# EAGLE design Procesor-MicroBit (EAGLE 9.4.0)
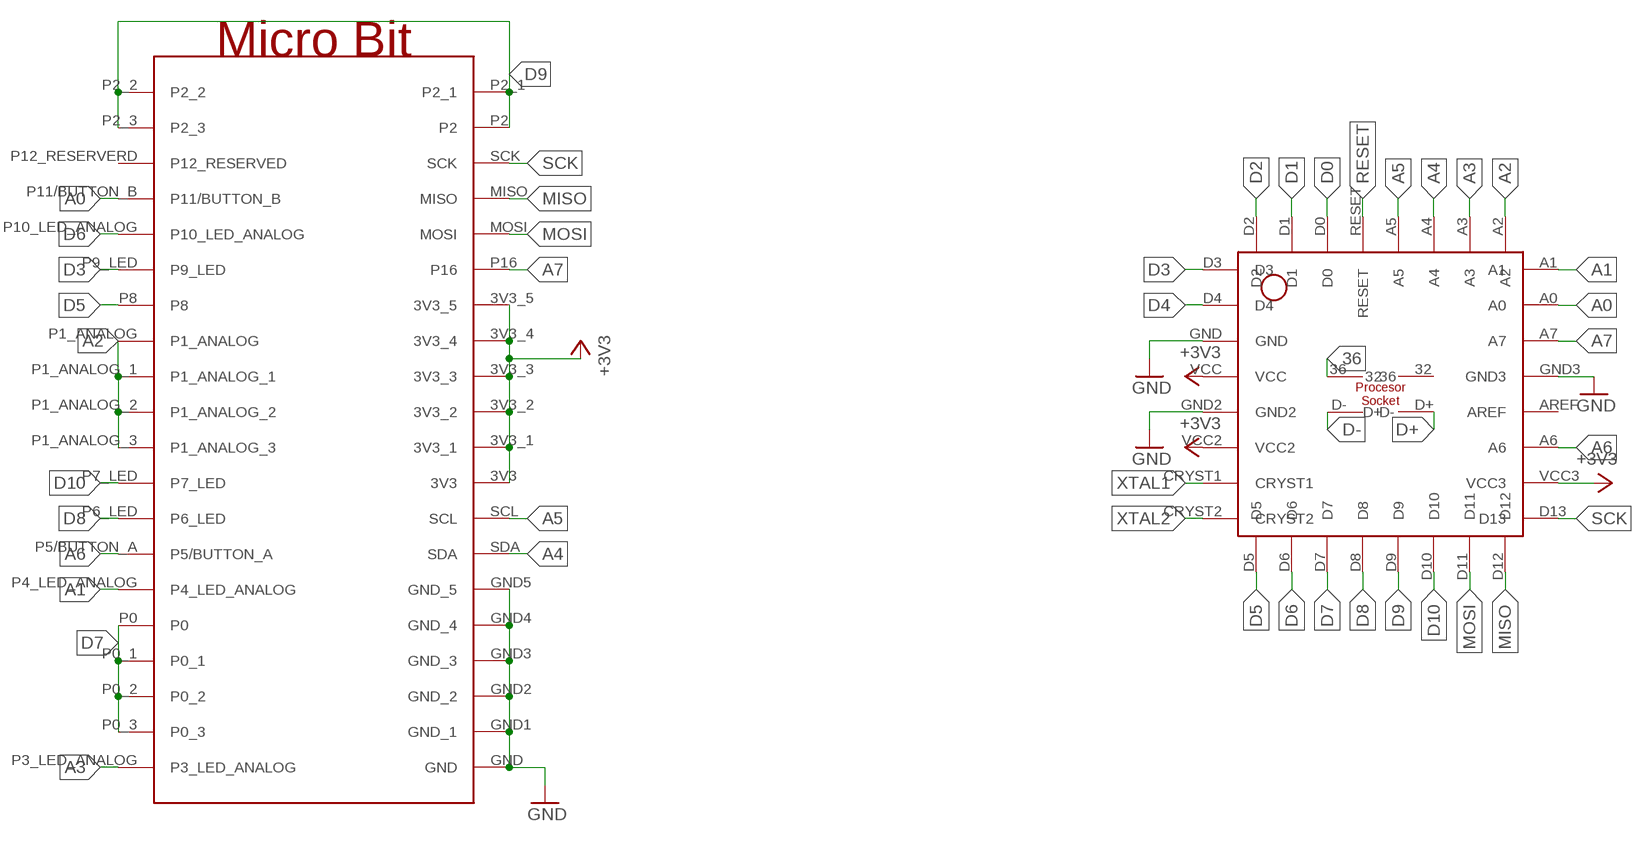
[diagram p0: schematic, sheet 1]

## Parts
U$1  MICRO_BIT  [MICRO_BIT]
U$2  PROCESSOR-SOCKET  [PROCESOR]

## Nets
36: U$2.36
+3V3: U$1.3V3 U$1.3V3_1 U$1.3V3_2 U$1.3V3_3 U$1.3V3_4 U$1.3V3_5 U$2.VCC U$2.VCC2 U$2.VCC3
A0: U$1.P11/BUTTON_B U$2.A0
A1: U$1.P4_LED_ANALOG U$2.A1
A2: U$1.P1_ANALOG U$1.P1_ANALOG_1 U$1.P1_ANALOG_2 U$1.P1_ANALOG_3 U$2.A2
A3: U$1.P3_LED_ANALOG U$2.A3
A4: U$1.SDA U$2.A4
A5: U$1.SCL U$2.A5
A6: U$1.P5/BUTTON_A U$2.A6
A7: U$1.P16 U$2.A7
D0: U$2.D0
D1: U$2.D1
D2: U$2.D2
D3: U$1.P9_LED U$2.D3
D4: U$2.D4
D5: U$1.P8 U$2.D5
D6: U$1.P10_LED_ANALOG U$2.D6
D7: U$1.P0 U$1.P0_1 U$1.P0_2 U$1.P0_3 U$2.D7
D8: U$1.P6_LED U$2.D8
D9: U$1.P2 U$1.P2_1 U$1.P2_2 U$1.P2_3 U$2.D9
D10: U$1.P7_LED U$2.D10
D+: U$2.D+
D-: U$2.D-
GND: U$1.GND U$1.GND1(GND_1) U$1.GND2(GND_2) U$1.GND3(GND_3) U$1.GND4(GND_4) U$1.GND5(GND_5) U$2.GND U$2.GND2 U$2.GND3
MISO: U$1.MISO U$2.D12
MOSI: U$1.MOSI U$2.D11
RESET: U$2.RESET
SCK: U$1.SCK U$2.D13
XTAL1: U$2.CRYST1
XTAL2: U$2.CRYST2
Unconnected: U$1.P12_RESERVERD(P12_RESERVED) U$2.32 U$2.AREF

## Library data of the parts
U$1 = Cing Library:MICRO_BIT
U$2 = Cing Library:PROCESSOR-SOCKET

## Board
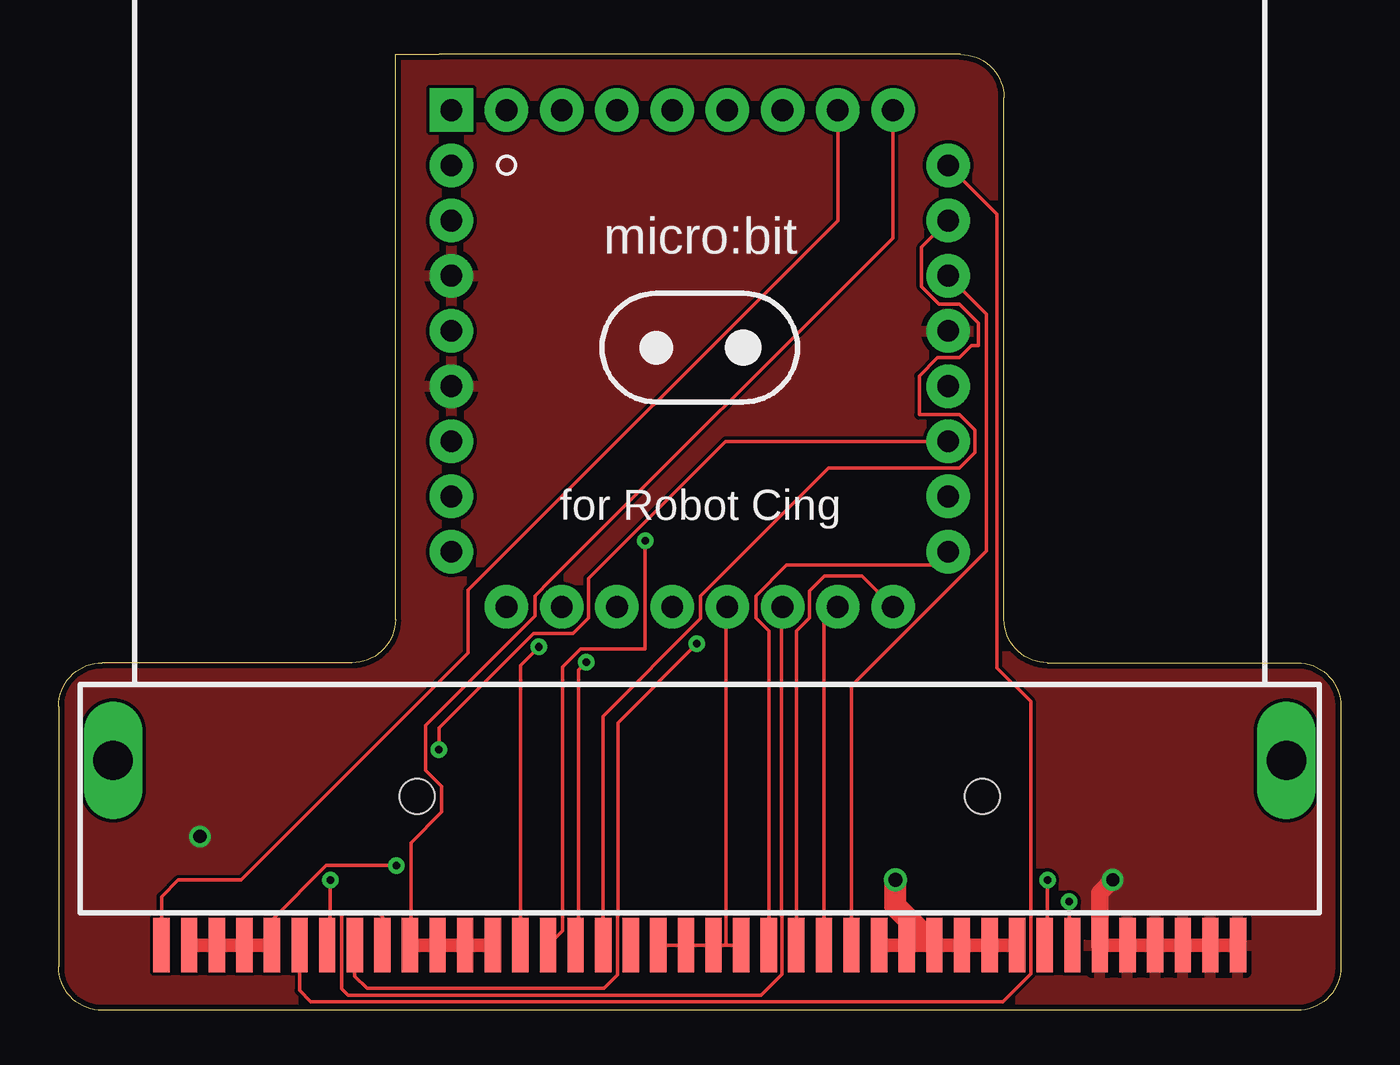
[diagram p1: board, top side]
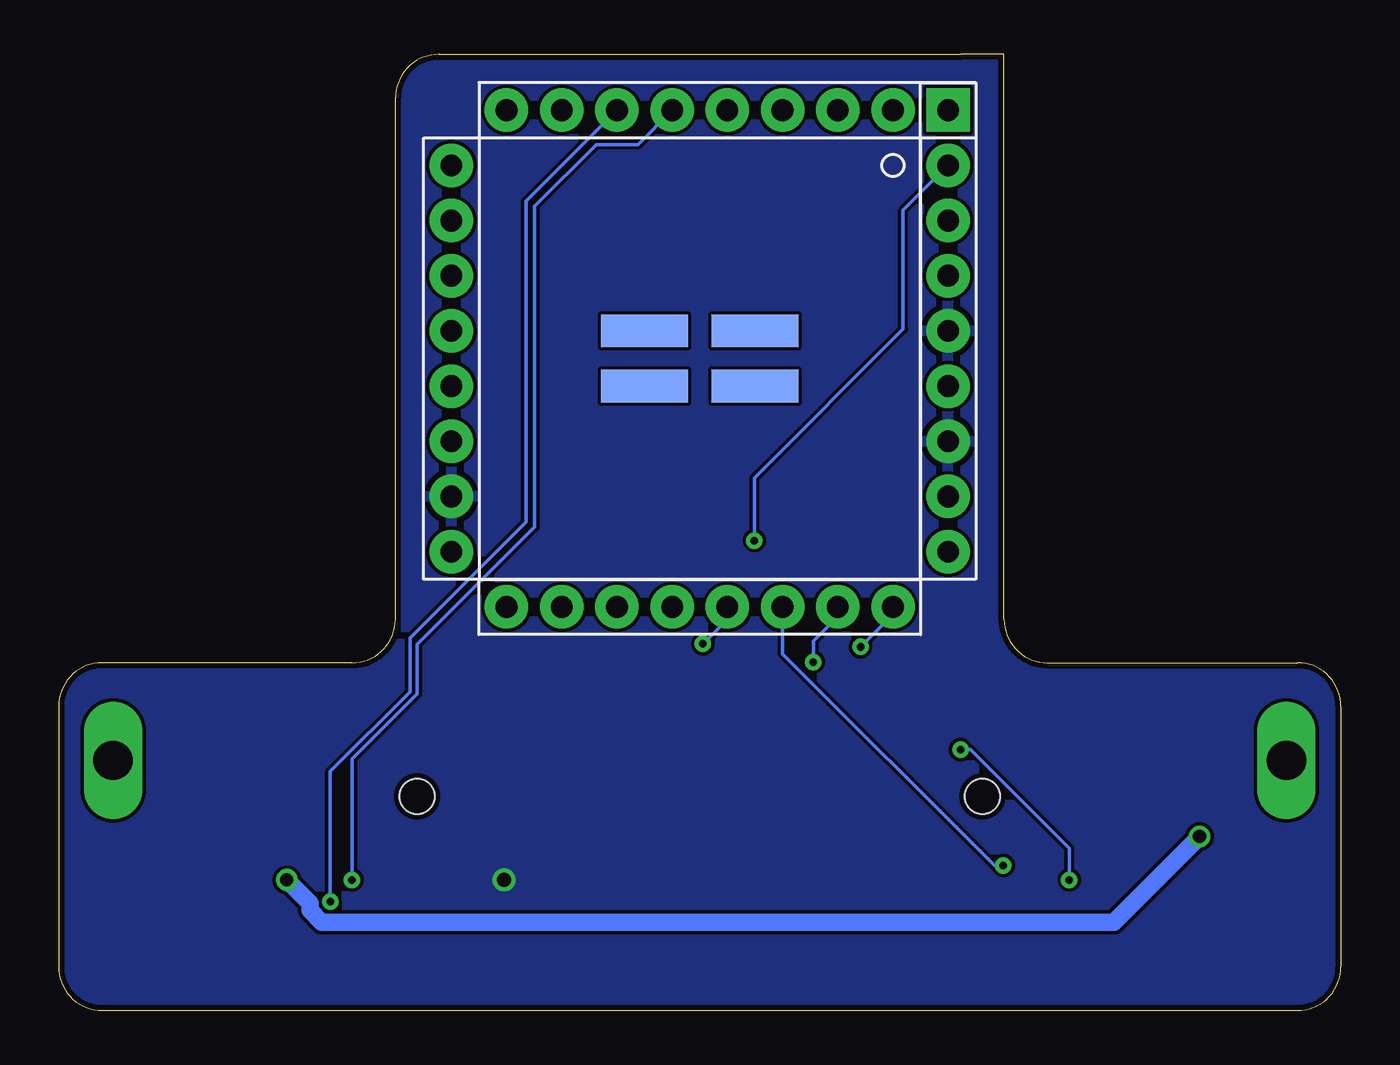
[diagram p2: board, bottom side, seen from below]

Size 59 x 44 mm. Coordinates in mm from the lower left corner, seen from the top.
Outline: 59,14 59,2 arc-90 57,0 2,0 arc-90 0,2 0,14 arc-90 2,16 13.5,16 arc90 15.5,18 15.5,42 15.5,44 17.5,44 41.5,44 arc-90 43.5,42 43.5,18 arc90 45.5,16 57,16 arc-90 59,14
Copper layers (1*16): Top 0.035mm / dielectric 1.5mm / Bottom 0.035mm
Design rules "default *": minimum track width 6mil, minimum drill 0.35mm, track to track 6mil, track to pad 6mil, pad to pad 6mil, via to via 6mil, smd to smd 6mil, copper to edge 10mil, drill to drill 6mil, minimum pad ring 10mil, minimum via ring 8mil, stop-mask expansion 4mil, vias tented up to drill 0mil, thermal gap 10mil

### Footprints (pad centres in the part's own frame; a part is rotated, then mirrored left to right if it is on the bottom)
MICRO_BIT = smd 0.75 x 2.5: 3V3 14.605,0; 3V3_1 13.335,0; 3V3_2 12.065,0; 3V3_3 10.795,0; 3V3_4 9.525,0; 3V3_5 8.255,0; GND 24.765,0; GND1 23.495,0; GND2 22.225,0; GND3 20.955,0; GND4 19.685,0; GND5 18.415,0; MISO 4.445,0; MOSI 5.715,0; P0 -19.685,0; P0_1 -20.955,0; P0_2 -22.225,0; P0_3 -23.495,0; P1_ANALOG -9.525,0; P1_ANALOG_1 -10.795,0; P1_ANALOG_2 -12.065,0; P1_ANALOG_3 -13.335,0; P2 1.905,0; P2_1 0.635,0; P2_2 -0.635,0; P2_3 -1.905,0; P3_LED_ANALOG -24.765,0; P4_LED_ANALOG -18.415,0; P5/BUTTON_A -17.145,0; P6_LED -15.875,0; P7_LED -14.605,0; P8 -8.255,0; P9_LED -6.985,0; P10_LED_ANALOG -5.715,0; P11/BUTTON_B -4.445,0; P12_RESERVERD -3.175,0; P16 6.985,0; SCK 3.175,0; SCL 15.875,0; SDA 17.145,0 | drill 1.8 long: P$45 -27,8.51; P$46 27,8.51 | hole 1.6: -13,6.85; 13,6.85
PROCESOR = smd 4 x 1.5 bottom: 32 2.54,1.27; 36 -2.54,1.27; D+ 2.54,-1.27; D- -2.54,-1.27 | drill 1 pad 2: A0 11.43,6.35; A1 11.43,8.89; A2 8.89,11.43; A3 6.35,11.43; A4 3.81,11.43; A5 1.27,11.43; A6 11.43,-3.81; A7 11.43,3.81; AREF 11.43,-1.27; CRYST1 -11.43,-6.35; CRYST2 -11.43,-8.89; D0 -3.81,11.43; D1 -6.35,11.43; D2 -8.89,11.43; D3 -11.43,8.89; D4 -11.43,6.35; D5 -8.89,-11.43; D6 -6.35,-11.43; D7 -3.81,-11.43; D8 -1.27,-11.43; D9 1.27,-11.43; D10 3.81,-11.43; D11 6.35,-11.43; D12 8.89,-11.43; D13 11.43,-8.89; GND -11.43,3.81; GND2 -11.43,-1.27; GND3 11.43,1.27; RESET -1.27,11.43; VCC -11.43,1.27; VCC2 -11.43,-3.81; VCC3 11.43,-6.35 | drill 1 pad 2 square: P$1 -11.43,11.43

### Placement (x,y rotation side)
U$1  29.5,3 0 top
U$2  29.5,30 0 top

### Tracks (layer width: path | path; a pad name or v marks a point on that pad's centre or on a via)
+3V3  (via drill 0.65)
  Top 0.61: U$1.3V3_5 U$1.3V3_4 U$1.3V3_3 U$1.3V3_2 U$1.3V3_1 U$1.3V3
  Top 1.016: U$1.3V3_3 38.5,4.8 v38.5,6
  pour Bottom: -2.74,-1.24 -2.74,53.24 61.74,53.24 61.74,-1.24
A0
  Top 0.152: U$2.A0 39.7,35.12 39.7,33.3 40.5,32.5 41.44,32.5 42.31,31.62 42.31,30.6 42,30.6 41.44,30.04 40.44,30.04 39.6,29.2 39.6,27.42 41.44,27.42 42.16,26.7 42.16,25.68 41.44,24.96 35.42,24.96 29.54,19.08 29.54,18.03 25.05,13.54 U$1.P11/BUTTON_B
A1
  Top 0.152: U$1.P4_LED_ANALOG 11.09,0.91 11.6,0.4 43.45,0.4 44.73,1.67 44.73,14.21 43.17,15.77 43.17,36.65 U$2.A1
A2
  Top 0.152: U$1.P1_ANALOG_3 16.21,3.05 16.21,7.71 17.63,9.13 17.63,10.32 16.89,11.05 16.89,13.12 21.92,18.14 21.92,19.08 22.64,19.8 38.39,35.55 U$2.A2
  Top 0.61: U$1.P1_ANALOG_3 U$1.P1_ANALOG_2 U$1.P1_ANALOG_1 U$1.P1_ANALOG
A3
  Top 0.152: U$1.P3_LED_ANALOG 4.73,5.23 5.5,6 8.4,6 18.85,16.45 18.85,19.35 35.85,36.35 U$2.A3
A4  (via drill 0.35)
  Top 0.152: v46.5,5 46.5,3.14 U$1.SDA
  Bottom 0.152: v46.5,5 46.5,11 42.84,14.66 42.84,17.13 37.5,22.47 37.5,37.24 U$2.A4
A5  (via drill 0.35)
  Top 0.152: v45.5,6 45.5,3.12 U$1.SCL
  Bottom 0.152: U$2.A5 32.35,39.85 34.26,39.85 37.09,37.01 37.09,22.24 42.5,16.84 42.5,14.57 45.5,11.57 v45.5,6
A6  (via drill 0.35)
  Top 0.152: U$2.A6 30.69,26.19 24.38,19.88 24.38,18.06 23.66,17.34 21.84,17.34 17.5,13 v17.5,12 | v12.5,6 12.5,3.14 U$1.P5/BUTTON_A
  Bottom 0.152: v12.5,6 12.5,7.45 17.05,12 v17.5,12
A7
  Top 0.152: U$1.P16 36.48,14.93 42.69,21.13 42.69,32.05 U$2.A7
D3  (via drill 0.35)
  Top 0.152: U$1.P9_LED 23.18,3.67 23.18,15.8 24.02,16.63 26.98,16.63 v26.98,21.62
  Bottom 0.152: v26.98,21.62 26.98,24.5 20.14,31.34 20.14,36.82 U$2.D3
D5  (via drill 0.35)
  Top 0.152: U$1.P8 21.24,15.88 v22.1,16.73
  Bottom 0.152: U$2.D5 20.61,18.21 v22.1,16.73
D6  (via drill 0.35)
  Top 0.152: v24.27,16.03 23.91,15.67 23.91,3.13 U$1.P10_LED_ANALOG
  Bottom 0.152: U$2.D6 23.15,18.12 24.27,17 v24.27,16.03
D7  (via drill 0.35)
  Top 0.152: U$1.P0 9.82,4.17 12.31,6.67 v15.53,6.67
  Top 0.61: U$1.P0_3 U$1.P0_2 U$1.P0_1 U$1.P0
  Bottom 0.152: U$2.D7 25.69,16.41 15.95,6.67 v15.53,6.67
D8  (via drill 0.35)
  Top 0.152: U$1.P6_LED 13.62,1.57 14.19,1.01 25.1,1.01 25.72,1.63 25.72,4.34 25.73,4.35 25.73,13.24 v29.36,16.87
  Bottom 0.152: U$2.D8 28.23,18 v29.36,16.87
D9
  Top 0.152: U$1.P2_3 U$1.P2_2 U$1.P2_1 30.7,3 | 30.7,3 U$1.P2 | 30.7,3 30.7,18.5 U$2.D9
D10
  Top 0.152: U$2.D10 33.27,18.52 33.27,4.36 33.28,4.34 33.28,1.66 32.33,0.7 13.32,0.7 13.02,1 13.02,4.34 13.16,4.48 14.72,4.48 14.89,4.3 U$1.P7_LED
GND  (via drill 0.6)
  Top 0.61: U$1.GND U$1.GND1 U$1.GND2 U$1.GND3 U$1.GND4 U$1.GND5
  Top 0.813: U$1.GND5 47.91,5.41 v48.5,6
  Bottom 0.813: v48.5,6 47.44,4.94 47.44,4.61 46.89,4.06 10.44,4.06 v6.5,8
  pour Top: -2.74,-1.24 -2.74,53.24 61.74,53.24 61.74,-1.24
MISO
  Top 0.152: U$2.D12 36.96,20 35.24,20 34.54,19.29 34.54,18.06 33.95,17.47 U$1.MISO
MOSI
  Top 0.152: U$2.D11 35.22,17.94 U$1.MOSI
SCK
  Top 0.152: U$1.SCK 32.67,17.47 32.08,18.06 32.08,19.08 33.5,20.5 40.32,20.5 U$2.D13